# EAGLE design metiumacs (EAGLE 7.2.0)
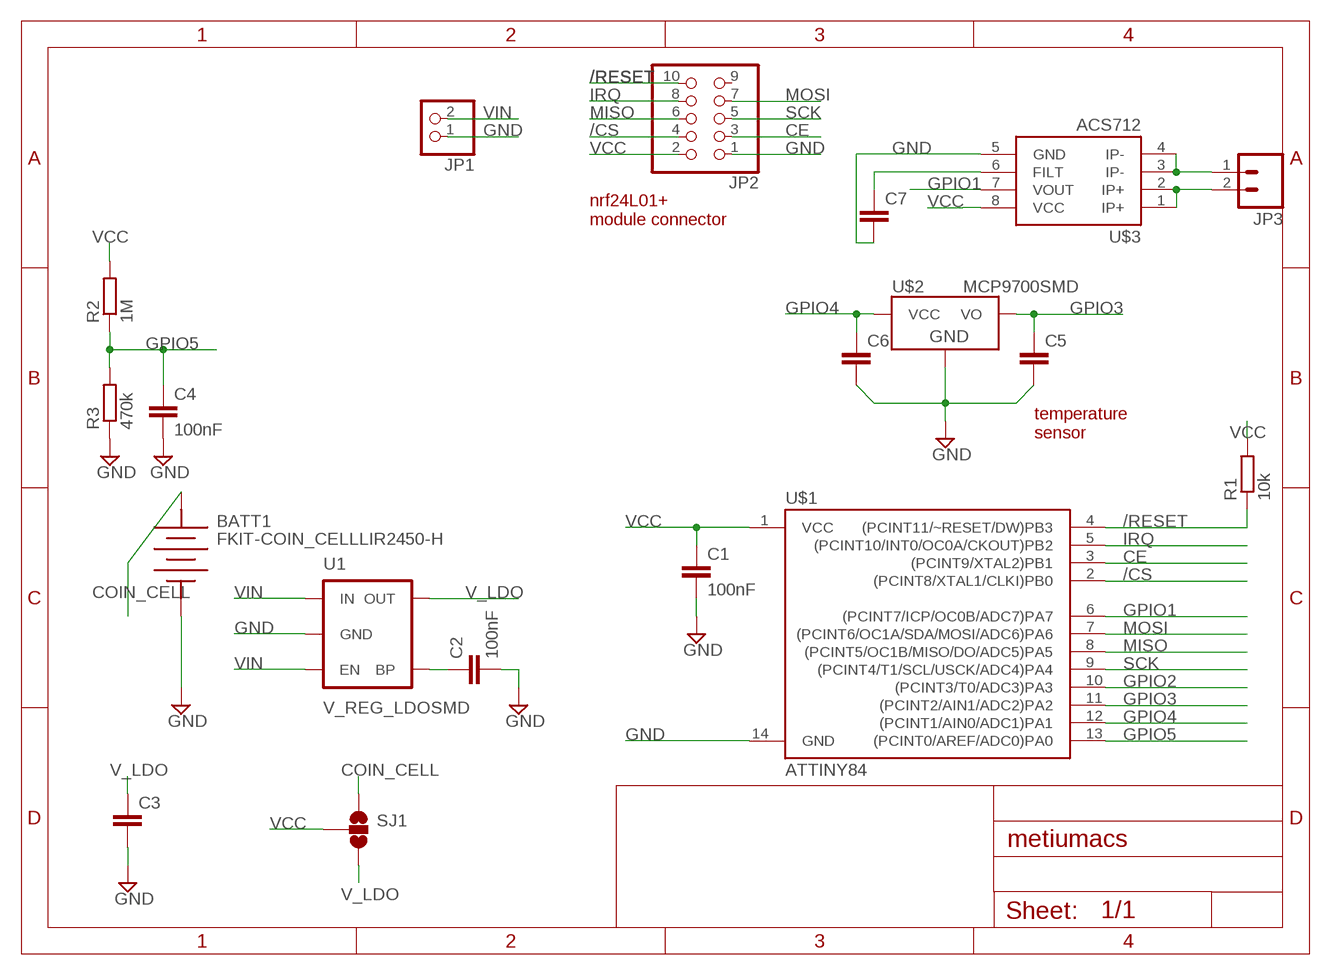
[diagram p0: schematic, sheet 1]

## Parts
BATT1  FKIT-COIN_CELLLIR2450-H  [FKIT-LIR2450-H]
C1  100nF  C-EUC0805  [C0805]
C2  100nF  C-EUC0805  [C0805]
C3  C-EUC0805  [C0805]
C4  100nF  C-EUC0805  [C0805]
C5  C-EUC0805  [C0805]
C6  C-EUC0805  [C0805]
C7  CAP0805  [0805]
JP1  HEADER-1X2ROUND  [1X02_ROUND]
JP2  PINHD-2X5  [2X05]
JP3  M02PTH4  [1X02_XTRA_BIG]
R1  10k  R-EU_R0805  [R0805]
R2  1M  R-EU_R0805  [R0805]
R3  470k  R-EU_R0805  [R0805]
SJ1  SOLDERJUMPER_2WAYS  [SJ_3]
U1  V_REG_LDOSMD  [SOT23-5]
U$1  ATTINY84  [SO14]
U$2  MCP9700SMD  [SOT23-3]
U$3  ACS712  [SO08]

## Nets
/CS: JP2.4 U$1.2((PCINT8/XTAL1/CLKI)PB0)
/RESET: JP2.10 R1.1 U$1.4((PCINT11/~RESET/DW)PB3)
CE: JP2.3 U$1.3((PCINT9/XTAL2)PB1)
COIN_CELL: BATT1.POS SJ1.1
FS1: JP3.1 U$3.3(IP-) U$3.4(IP-)
FS2: JP3.2 U$3.1(IP+) U$3.2(IP+)
GND: BATT1.NEG C1.2 C2.2 C3.2 C4.2 C5.2 C6.2 C7.2 JP1.1 JP2.1 R3.1 U1.2(GND) U$1.14(GND) U$2.3(GND) U$3.5(GND)
GPIO1: U$1.6((PCINT7/ICP/OC0B/ADC7)PA7) U$3.7(VOUT)
GPIO2: U$1.10((PCINT3/T0/ADC3)PA3)
GPIO3: C5.1 U$1.11((PCINT2/AIN1/ADC2)PA2) U$2.2(VO)
GPIO4: C6.1 U$1.12((PCINT1/AIN0/ADC1)PA1) U$2.1(VCC)
GPIO5: C4.1 R2.1 R3.2 U$1.13((PCINT0/AREF/ADC0)PA0)
IRQ: JP2.8 U$1.5((PCINT10/INT0/OC0A/CKOUT)PB2)
MISO: JP2.6 U$1.8((PCINT5/OC1B/MISO/DO/ADC5)PA5)
MOSI: JP2.7 U$1.7((PCINT6/OC1A/SDA/MOSI/ADC6)PA6)
N$1: C2.1 U1.4(BP)
N$2: C7.1 U$3.6(FILT)
SCK: JP2.5 U$1.9((PCINT4/T1/SCL/USCK/ADC4)PA4)
V_LDO: C3.1 SJ1.3 U1.5(OUT)
VCC: C1.1 JP2.2 R1.2 R2.2 SJ1.2 U$1.1(VCC) U$3.8(VCC)
VIN: JP1.2 U1.1(IN) U1.3(EN)
Unconnected: JP2.9

## Notes on the sheet
- nrf24L01+ 
  module connector
- temperature
  sensor

## Library data of the parts
BATT1 = SparkFun-Electromechanical:FKIT-COIN_CELL: Fabrick.it Coin Cell Holder Coin cell holder for 24.5mm rechargable coin cell
C1-C6 = rcl:C-EU: CAPACITOR, European symbol
C7 = SparkFun-Capacitors:CAP: Capacitor Standard 0603 ceramic capacitor, and 0.1" leaded capacitor.
JP1 = microbuilder:HEADER-1X2: PIN HEADER
JP2 = pinhead:PINHD-2X5: PIN HEADER
JP3 = SparkFun-Connectors:M02: Standard 2-pin 0.1" header. Use with - straight break away headers ( PRT-00116) - right angle break away headers (PRT-00553) - swiss pins (PRT-00743) - machine pins (PRT-00117) - female headers (PRT-00115) Molex polarized connector foot print use with: PRT-08233 with associated crimp pins and housings. 2.54_SCREWTERM for use with PRT-10571. 3.5mm Screw Terminal footprints for PRT-08084 5mm Screw Terminal footprints for use with PRT-08432
R1-R3 = rcl:R-EU_: RESISTOR, European symbol
SJ1 = SparkFun-Passives:SOLDERJUMPER_2WAY: Solder Jumper 2 way solder jumper
U1 = SparkFun-PowerIC:V_REG_LDO: Voltage Regulator LDO Standard 150mA LDO voltage regulator in SOT-23 layout. Micrel part MIC5205. BP (by-pass) pin is used to lower output noise with 470pF cap.
U$1 = SparkFun-DigitalIC:ATTINY84: Atmel 14-pin 2/4/8kB flash uC
U$2 = SparkFun-Sensors:MCP9700: Analog-output temperature sensor
U$3 = SparkFun-AnalogIC:ACS712: Hall-effect-based isolated linear current sensor

## Board
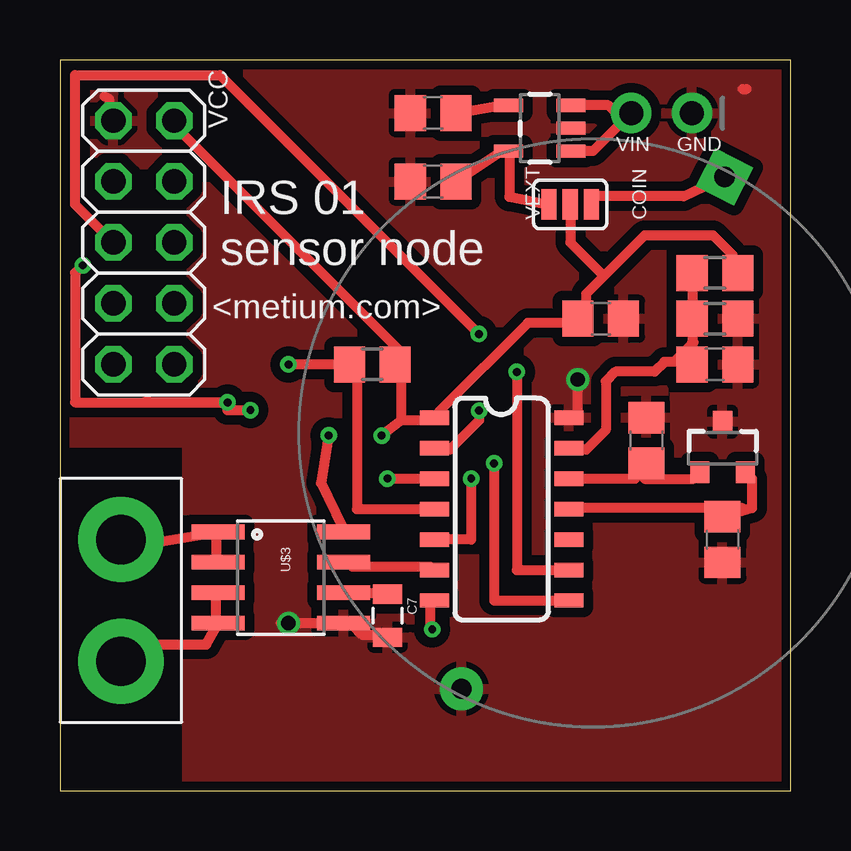
[diagram p1: board, top side]
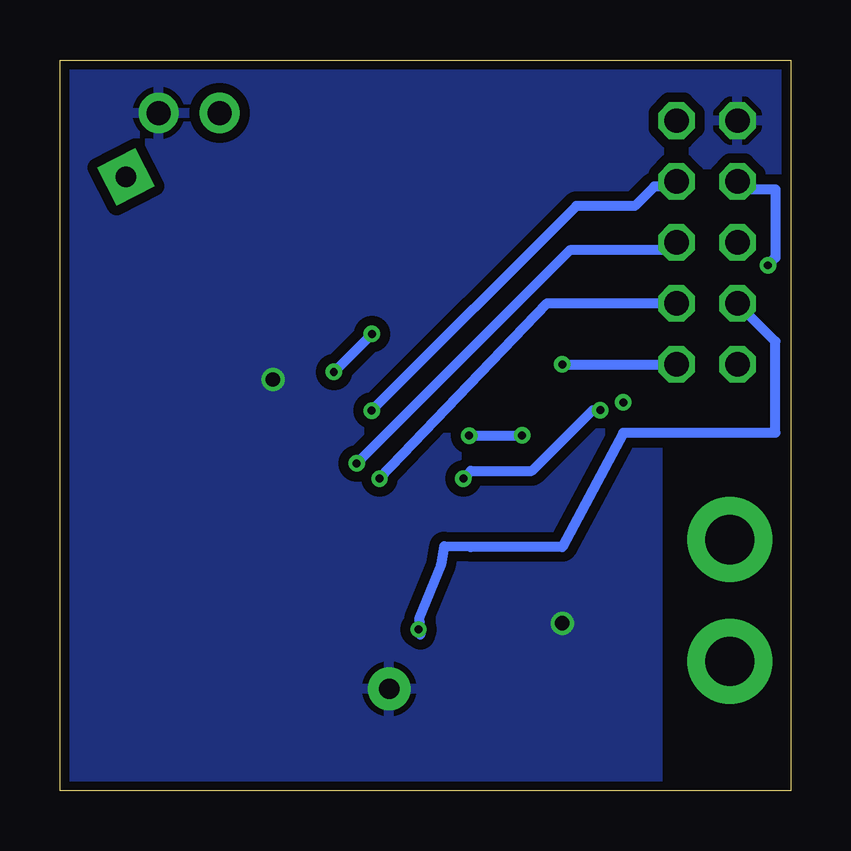
[diagram p2: board, bottom side, seen from below]

Size 30.47 x 30.47 mm. Coordinates in mm from the lower left corner, seen from the top.
Outline: 0,0 30.47,0 30.47,30.47 0,30.47 0,0
Copper layers (1*16): Top 0.0356mm / dielectric 1.5011mm / Bottom 0.0356mm
Design rules "LaenPCBOrder *": minimum track width 16mil, minimum drill 13mil, track to track 16mil, track to pad 16mil, pad to pad 16mil, via to via 16mil, smd to smd 6mil, copper to edge 15mil, drill to drill 6mil, minimum pad ring 7mil, minimum via ring 7mil, stop-mask expansion 4mil, vias tented up to drill 0mil, thermal gap 10mil
tRestrict: area 0.6,0.2 to 5.1,14.3
bRestrict: area 0.6,0.2 to 5.3,14.3

### Footprints (pad centres in the part's own frame; a part is rotated, then mirrored left to right if it is on the bottom)
FKIT-LIR2450-H = drill 0.85 pad 1.778: NEG -12,0 | drill 0.85 pad 1.778 square: POS 12,0
C0805 = smd 1.3 x 1.5: 1 -0.95,0; 2 0.95,0
0805 = smd 0.8 x 1.2: 1 -0.9,0; 2 0.9,0
1X02_ROUND = drill 1 pad 1.676: 1 -1.27,0; 2 1.27,0
2X05 = drill 1.016 octagon: 1 -5.08,-1.27; 2 -5.08,1.27; 3 -2.54,-1.27; 4 -2.54,1.27; 5 0,-1.27; 6 0,1.27; 7 2.54,-1.27; 8 2.54,1.27; 9 5.08,-1.27; 10 5.08,1.27
1X02_XTRA_BIG = drill 2.057 pad 3.556: 1 -2.54,0; 2 2.54,0
R0805 = smd 1.3 x 1.5: 1 -0.95,0; 2 0.95,0
SJ_3 = smd 0.635 x 1.27: 1 -0.889,0; 2 0,0; 3 0.889,0
SOT23-5 = smd 0.55 x 1.2: 1 -0.95,-1.3; 2 0,-1.3; 3 0.95,-1.3; 4 0.95,1.3; 5 -0.95,1.3
SO14 = smd 0.6 x 1.2: 1 -3.81,-2.8; 2 -2.54,-2.8; 3 -1.27,-2.8; 4 0,-2.8; 5 1.27,-2.8; 6 2.54,-2.8; 7 3.81,-2.8; 8 3.81,2.8; 9 2.54,2.8; 10 1.27,2.8; 11 0,2.8; 12 -1.27,2.8; 13 -2.54,2.8; 14 -3.81,2.8
SOT23-3 = smd 0.8 x 0.9: 1 -0.95,-1; 2 0.95,-1; 3 0,1.1
SO08 = smd 0.61 x 2.21: 1 -1.905,-2.616; 2 -0.635,-2.616; 3 0.635,-2.616; 4 1.905,-2.616; 5 1.905,2.616; 6 0.635,2.616; 7 -0.635,2.616; 8 -1.905,2.616

### Placement (x,y rotation side)
BATT1  22.23,14.92 62.8 top
C1  22.54,19.68 0 top
C2  15.56,28.26 180 top
C3  15.56,25.4 180 top
C4  27.3,17.78 0 top
C5  27.62,10.48 270 top
C6  24.45,14.61 90 top
C7  13.65,7.3 270 top
JP1  25.08,28.26 180 top
JP2  3.49,22.86 270 top
JP3  2.54,7.94 90 top
R1  13.02,17.78 0 top
R2  27.3,21.59 0 top
R3  27.3,19.68 180 top
SJ1  21.27,24.45 180 top
U1  20,27.62 90 top
U$1  18.41,11.75 270 top
U$2  27.62,14.29 0 top
U$3  9.21,8.89 270 top

### Tracks (layer width: path | path; a pad name or v marks a point on that pad's centre or on a via)
/CS  (via drill 0.33)
  Top 0.406: v17.48,15.85 17.48,15.44 16.26,14.22 15.85,14.22 U$1.2
  Bottom 0.406: v17.48,15.85 8.94,24.38 6.5,24.38 5.69,25.2 4.88,25.2 JP2.4
/RESET  (via drill 0.33)
  Top 0.406: U$1.4 12.38,11.75 12.38,17.78 R1.1 v9.53,17.78
  Bottom 0.406: v9.53,17.78 JP2.10
CE  (via drill 0.33)
  Top 0.406: v13.65,13.02 U$1.3 | v6.99,16.19 0.64,16.19 0.64,21.59 v0.95,21.91 | v6.99,16.19 3.49,16.19 3.66,16.26 | v7.94,15.88 6.99,15.88 v6.99,16.19
  Bottom 0.406: v0.95,21.91 0.64,22.23 0.64,25.08 1.91,25.08 JP2.3 | v7.94,15.88 8.26,15.88 10.79,13.34 13.34,13.34 v13.65,13.02
COIN_CELL
  Top 0.406: SJ1.1 22.35,24.79 26.01,24.79 BATT1.POS
FS1
  Top 0.406: JP3.1 2.85,5.69 3.25,6.1 6.1,6.1 U$3.4 6.5,6.91 6.5,8.13 U$3.3
FS2
  Top 0.406: JP3.2 2.85,10.16 U$3.1 6.5,10.57 6.5,9.75 U$3.2
GND  (via drill 0.6)
  Top 0.406: 28.45,29.26 28.62,29.26 | JP2.1 2.03,28.85 1.85,28.94 | U1.2 21.13,27.64 21.13,27.62 | v21.59,17.14 21.59,15.56 U$1.14 | 28.38,19.56 28.45,19.51 R3.1 | 28.26,18.1 C4.2 | 9.21,6.99 v9.53,6.99 U$3.5 12.19,6.91 12.6,6.5 13.41,6.5 C7.2
  pour Top: -0.32,-0.32 30.8,-0.32 30.8,30.8 -0.32,30.8
  pour Bottom: 0,0 30.48,0 30.48,30.48 0,30.48
GPIO1
  Top 0.406: U$1.6 15.44,9.35 12.19,9.35 U$3.7
GPIO3
  Top 0.406: U$2.2 28.85,13.01 28.85,11.79 C5.1 28.45,11.79 21.54,11.79 U$1.11
GPIO4
  Top 0.406: U$1.12 21.54,13.01 23.98,13.01 C6.1 24.38,13.01 26.42,13.01 U$2.1
GPIO5
  Top 0.406: R2.1 R3.2 26.36,18.69 | 26.36,18.69 C4.1 | U$1.13 21.54,14.22 21.95,14.22 22.76,15.04 22.76,17.07 23.16,17.48 24.79,17.48 25.2,17.88 25.6,17.88 26.42,18.69 26.36,18.69
IRQ  (via drill 0.33)
  Top 0.406: U$1.5 17.14,10.48 v17.14,13.02
  Bottom 0.406: v17.14,13.02 10.16,20.32 JP2.8
MISO  (via drill 0.33)
  Top 0.406: U$1.8 18.1,7.94 v18.1,13.65
  Bottom 0.406: v18.1,13.65 9.21,22.54 5.08,22.54 JP2.6
MOSI  (via drill 0.33)
  Top 0.406: U$1.7 15.44,7.72 15.44,6.91 v15.52,6.73
  Bottom 0.406: v15.52,6.73 15.44,6.5 15.49,7.19 14.59,9.41 14.45,10.19 13.34,10.16 9.53,10.16 6.99,14.92 0.64,14.92 0.64,18.73 JP2.7
N$1
  Top 0.406: C2.1 18.41,28.57 U1.4
N$2
  Top 0.406: U$3.6 13.65,8.26 C7.1
SCK  (via drill 0.33)
  Top 0.406: U$1.9 19.05,9.21 v19.05,17.46 | v17.46,19.05 6.67,29.84 0.64,29.84 0.64,24.45 JP2.5
  Bottom 0.406: v17.46,19.05 v19.05,17.46
V_LDO
  Top 0.406: C3.1 18.41,26.67 U1.5 18.73,26.67 18.73,24.77 SJ1.3
VCC  (via drill 0.33)
  Top 0.406: 22.68,21.46 21.95,20.73 21.95,19.91 C1.1 21.54,19.51 19.51,19.51 15.85,15.85 U$1.1 15.44,15.44 14.22,15.44 | 22.68,21.46 24.38,23.16 27.23,23.16 28.04,22.35 28.04,21.95 R2.2 | SJ1.2 21.27,22.86 22.68,21.46 | JP2.2 4.88,27.64 14.22,18.29 14.22,17.78 | v11.2,14.82 10.88,12.83 11.79,10.97 U$3.8 | 14.22,15.44 v13.41,14.81 | 13.82,17.48 R1.2 14.22,17.78 | 14.22,17.78 14.22,15.44 | 14.29,17.78 14.22,17.78
  Bottom 0.406: v13.41,14.81 v11.2,14.82
VIN
  Top 0.406: 23.5,27.94 22.23,26.67 21.59,26.67 U1.1 | 23.5,27.94 22.86,28.57 21.59,28.57 U1.3 | 23.5,27.94 JP1.2

### Text on the board
tNames: VCC | VIN | GND | VEXT | COIN | IRS 01 / sensor node | <metium.com>